# EAGLE schematic imu_ultrason_breakout (EAGLE 9.5.1)
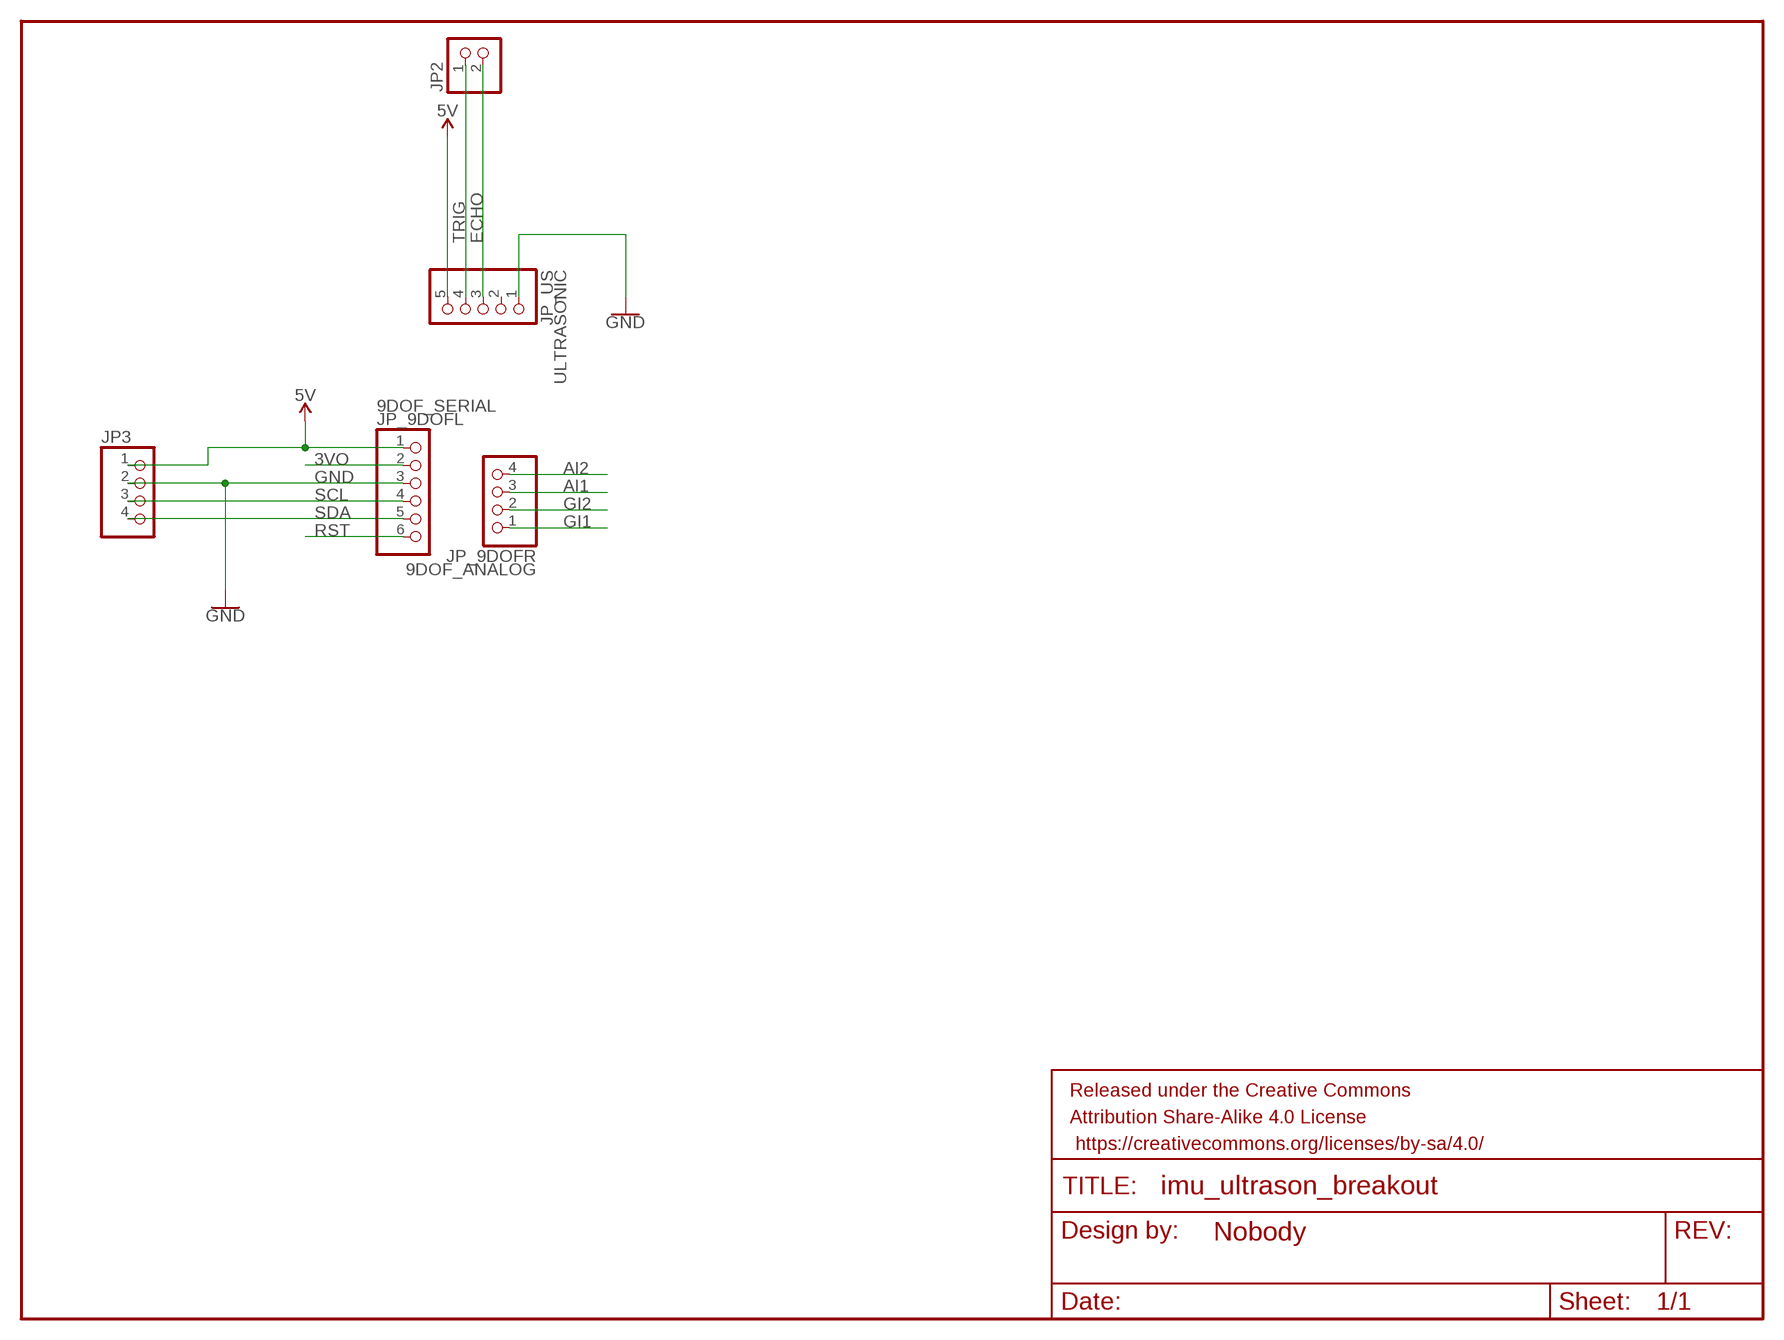
[diagram p0: schematic, sheet 1]

## Parts
FRAME1  FRAME-LETTERNO_PACKAGE  [DUMMY]
JP2  PINHD-1X2  [1X02]
JP3  PINHD-1X4  [1X04]
JP_9DOFL  PINHD-1X6  [1X06]
JP_9DOFR  PINHD-1X4  [1X04]
JP_US  PINHD-1X5  [1X05]

## Nets
3VO: JP_9DOFL.2
5V: JP3.1 JP_9DOFL.1 JP_US.5
AI1: JP_9DOFR.3
AI2: JP_9DOFR.4
ECHO: JP2.2 JP_US.3
GI1: JP_9DOFR.1
GI2: JP_9DOFR.2
GND: JP3.2 JP_9DOFL.3 JP_US.1
RST: JP_9DOFL.6
SCL: JP3.3 JP_9DOFL.4
SDA: JP3.4 JP_9DOFL.5
TRIG: JP2.1 JP_US.4
Unconnected: JP_US.2

## Library data of the parts
FRAME1 = SparkFun-Aesthetics:FRAME-LETTER: Schematic Frame - Letter Standard 8.5x11 US Letter frame; DESIGNER: Nobody; VERSION: v01
JP2 = pinhead:PINHD-1X2: PIN HEADER
JP3 JP_9DOFR = pinhead:PINHD-1X4: PIN HEADER
JP_9DOFL = pinhead:PINHD-1X6: PIN HEADER
JP_US = pinhead:PINHD-1X5: PIN HEADER